# EAGLE schematic schematic (EAGLE 7.5.0)
weweeweeweewewewewew
TITLE: ATMega Wi-Fi remote
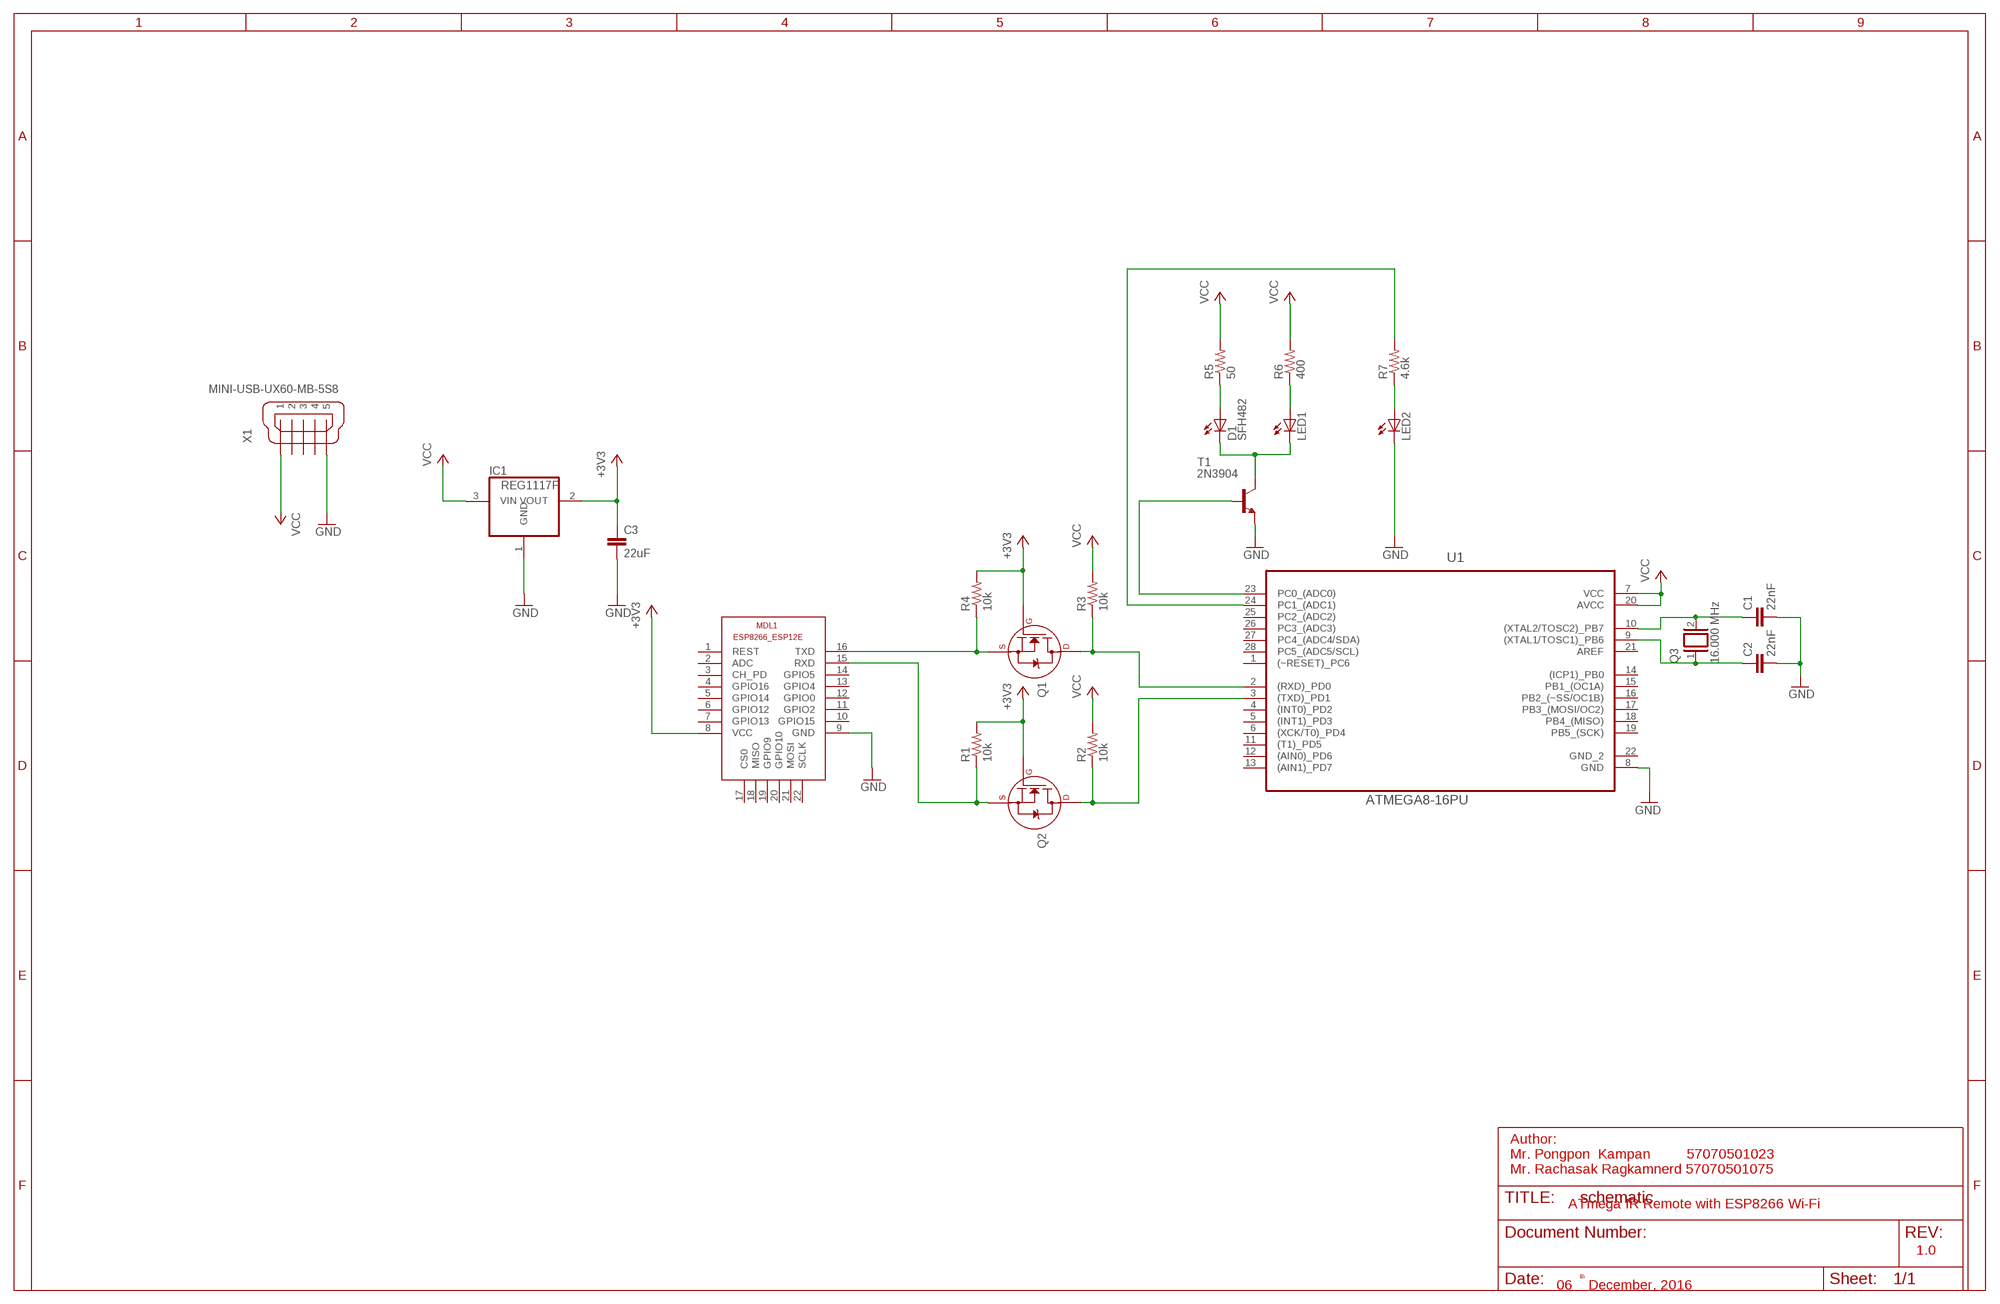
[diagram p0: schematic, sheet 1]
FRAME1 (FRAME_B_L): TITLE: ATMega WI-Fi Infrared Rewmote

## Parts
C1  22nF  C2,5-3  [C2.5-3]
C2  22nF  C2,5-3  [C2.5-3]
C3  22uF  C  [C0805]
D1  SFH482  [SFH482]
IC1  REG1117F  [DD-3]
LED1  LED5MM  [LED5MM]
LED2  LED5MM  [LED5MM]
MDL1  ESP8266-12EESP8266-ESP12E  [ESP8266-ESP12E]
Q1  2N7000_TO92  [TO-92]
Q2  2N7000_TO92  [TO-92]
Q3  16.000 MHz  XTAL  [Q]
R1  10k  10KOHM-1/4W-1%(PTH)HORIZ  [AXIAL-0.3]
R2  10k  10KOHM-1/4W-1%(PTH)HORIZ  [AXIAL-0.3]
R3  10k  10KOHM-1/4W-1%(PTH)HORIZ  [AXIAL-0.3]
R4  10k  10KOHM-1/4W-1%(PTH)HORIZ  [AXIAL-0.3]
R5  50  1KOHM-1/4W-1%(PTH)  [AXIAL-0.3]
R6  400  1KOHM-1/4W-1%(PTH)  [AXIAL-0.3]
R7  4.6k  1KOHM-1/4W-1%(PTH)  [AXIAL-0.3]
T1  2N3904  [TO92]
U1  ATMEGA8-16PU  [DIP254P762X457-28]
X1  MINI-USB-UX60-MB-5S8  [UX60-MB-5S8]

## Nets
+3V3: C3.1 IC1.2(VOUT) MDL1.8(VCC) Q1.2(G) Q2.2(G) R1.P$2 R4.P$2
GND: C1.2 C2.2 C3.2 IC1.1(GND) LED2.K(C) MDL1.9(GND) T1.3(E) U1.8(GND) X1.5
N$1: MDL1.15(RXD) Q2.1(S) R1.P$1
N$2: MDL1.16(TXD) Q1.1(S) R4.P$1
N$3: Q2.3(D) R2.P$1 U1.3((TXD)_PD1)
N$4: Q1.3(D) R3.P$1 U1.2((RXD)_PD0)
N$5: T1.2(B) U1.23(PC0_(ADC0))
N$6: D1.A R5.P$1
N$7: LED1.A R6.P$1
N$8: D1.K(C) LED1.K(C) T1.1(C)
N$10: LED2.A R7.P$1
N$11: R7.P$2 U1.24(PC1_(ADC1))
N$12: C1.1 Q3.2 U1.10((XTAL2/TOSC2)_PB7)
N$13: C2.1 Q3.1 U1.9((XTAL1/TOSC1)_PB6)
VCC: IC1.3(VIN) R2.P$2 R3.P$2 R5.P$2 R6.P$2 U1.7(VCC) U1.20(AVCC) X1.1
Unconnected: MDL1.1(REST) MDL1.2(ADC) MDL1.3(CH_PD) MDL1.4(GPIO16) MDL1.5(GPIO14) MDL1.6(GPIO12) MDL1.7(GPIO13) MDL1.10(GPIO15) MDL1.11(GPIO2) MDL1.12(GPIO0) MDL1.13(GPIO4) MDL1.14(GPIO5) MDL1.17(CS0) MDL1.18(MISO) MDL1.19(GPIO9) MDL1.20(GPIO10) MDL1.21(MOSI) MDL1.22(SCLK) U1.1((~RESET)_PC6) U1.4((INT0)_PD2) U1.5((INT1)_PD3) U1.6((XCK/T0)_PD4) U1.11((T1)_PD5) U1.12((AIN0)_PD6) U1.13((AIN1)_PD7) U1.14((ICP1)_PB0) U1.15(PB1_(OC1A)) U1.16(PB2_(~SS/OC1B)) U1.17(PB3_(MOSI/OC2)) U1.18(PB4_(MISO)) U1.19(PB5_(SCK)) U1.21(AREF) U1.22(GND_2) U1.25(PC2_(ADC2)) U1.26(PC3_(ADC3)) U1.27(PC4_(ADC4/SDA)) U1.28(PC5_(ADC5/SCL)) X1.2 X1.3 X1.4

## Notes on the sheet
- Author:
  Mr. Pongpon  Kampan         57070501023
  Mr. Rachasak Ragkamnerd 57070501075
- ATmega IR Remote with ESP8266 Wi-Fi
- 1.0
- th
- 06    December, 2016

## Library data of the parts
C1 C2 = capacitor-wima:C: CAPACITOR naming: grid - package width
C3 = eagle-ltspice:C: CAPACITOR, European symbol; SPICEMODEL: NONE; SPICEPREFIX: C
D1 = led:SFH482: IR LED infrared emitting diode, Infineon
IC1 = burr-brown:REG1117: 800mA and 1A Low Dropout (LDO) Positive Regulator 1.8V, 2.5V, 2.85V, 3.3V, 5V, and Adj; MF: TEXAS INSTRUMENTS; MPN: REG1117FAKTTT; OC_FARNELL: 1296120; OC_NEWARK: 87H2562
LED1 LED2 = led:LED: LED OSRAM: - CHIPLED LG R971, LG N971, LY N971, LG Q971, LY Q971, LO R971, LY R971 LH N974, LH R974 LS Q976, LO Q976, LY Q976 LO Q996 - Hyper CHIPLED LW Q18S LB Q993, LB Q99A, LB R99A - SideLED LS A670, LO A670, LY A670, LG A670, LP A670 LB A673, LV A673, LT A673, LW A673 LH A674 LY A675 LS A676, LA A676, LO A676, LY A676, LW A676 LS A679, LY A679, LG A679 - Hyper Micro SIDELED® LS Y876, LA Y876, LO Y876, LY Y876 LT Y87S - SmartLED LW L88C, LW L88S LB L89C, LB L89S, LG L890 LS L89K, LO L89K, LY L89K LS L896, LA L896, LO L896, LY L896 - TOPLED LS T670, LO T670, LY T670, LG T670, LP T670 LSG T670, LSP T670, LSY T670, LOP T670, LYG T670 LG T671, LOG T671, LSG T671 LB T673, LV T673, LT T673, LW T673 LH T674 LS T676, LA T676, LO T676, LY T676, LB T676, LH T676, LSB T676, LW T676 LB T67C, LV T67C, LT T67C, LS T67K, LO T67K, LY T67K, LW E67C LS E67B, LA E67B, LO E67B, LY E67B, LB E67C, LV E67C, LT E67C LW T67C LS T679, LY T679, LG T679 LS T770, LO T770, LY T770, LG T770, LP T770 LB T773, LV T773, LT T773, LW T773 LH T774 LS E675, LA E675, LY E675, LS T675 LS T776, LA T776, LO T776, LY T776, LB T776 LHGB T686 LT T68C, LB T68C - Hyper Mini TOPLED® LB M676 - Mini TOPLED Santana® LG M470 LS M47K, LO M47K, LY M47K Source: http://www.osram.convergy.de LUXEON: - LUMILED® LXK2-PW12-R00, LXK2-PW12-S00, LXK2-PW14-U00, LXK2-PW14-V00 LXK2-PM12-R00, LXK2-PM12-S00, LXK2-PM14-U00 LXK2-PE12-Q00, LXK2-PE12-R00, LXK2-PE12-S00, LXK2-PE14-T00, LXK2-PE14-U00 LXK2-PB12-K00, LXK2-PB12-L00, LXK2-PB12-M00, LXK2-PB14-N00, LXK2-PB14-P00, LXK2-PB14-Q00 LXK2-PR12-L00, LXK2-PR12-M00, LXK2-PR14-Q00, LXK2-PR14-R00 LXK2-PD12-Q00, LXK2-PD12-R00, LXK2-PD12-S00 LXK2-PH12-R00, LXK2-PH12-S00 LXK2-PL12-P00, LXK2-PL12-Q00, LXK2-PL12-R00 Source: www.luxeon.com KINGBRIGHT: KA-3528ASYC Source: www.kingbright.com
MDL1 = ESP8266-ESP12E:ESP8266-12E: ESP8266-12E with additional I/O and GPIO04/05 corrected The author cannot warrant that this library is free from error or will meet your specific requirements. Created by PuceBaboon.com. Komagane, Nagano, JAPAN
Q1 Q2 = transistors:2N700*: 2N7000, 2N7002, NDS7002A N-channel enhancement mode MOSFET
Q3 = special:XTAL: CRYSTAL
R1-R4 = SparkFun-Resistors:10KOHM-1/4W-1%(PTH): RES-12183; PROD_ID: RES-12183
R5-R7 = SparkFun-Resistors:1KOHM-1/4W-1%(PTH): RES-12182; PROD_ID: RES-12182; VALUE: 1K
T1 = transistor:2N3904: NPN TRANSISTOR
U1 = Atmel_By_element14_Batch_1-00:ATMEGA8-16PU: Programmable Flash; DESCRIPTION: Programmable Flash; MPN: ATMEGA8-16PU; OC_FARNELL: 9171380; OC_NEWARK: 01M6901; PACKAGE: PCDIP-28; SUPPLIER: ATMEL
X1 = con-hirose:MINI-USB-: MINI USB Connector Source: http://www.hirose.co.jp/cataloge_hp/e24000019.pdf; OC_FARNELL: unknown; OC_NEWARK: unknown